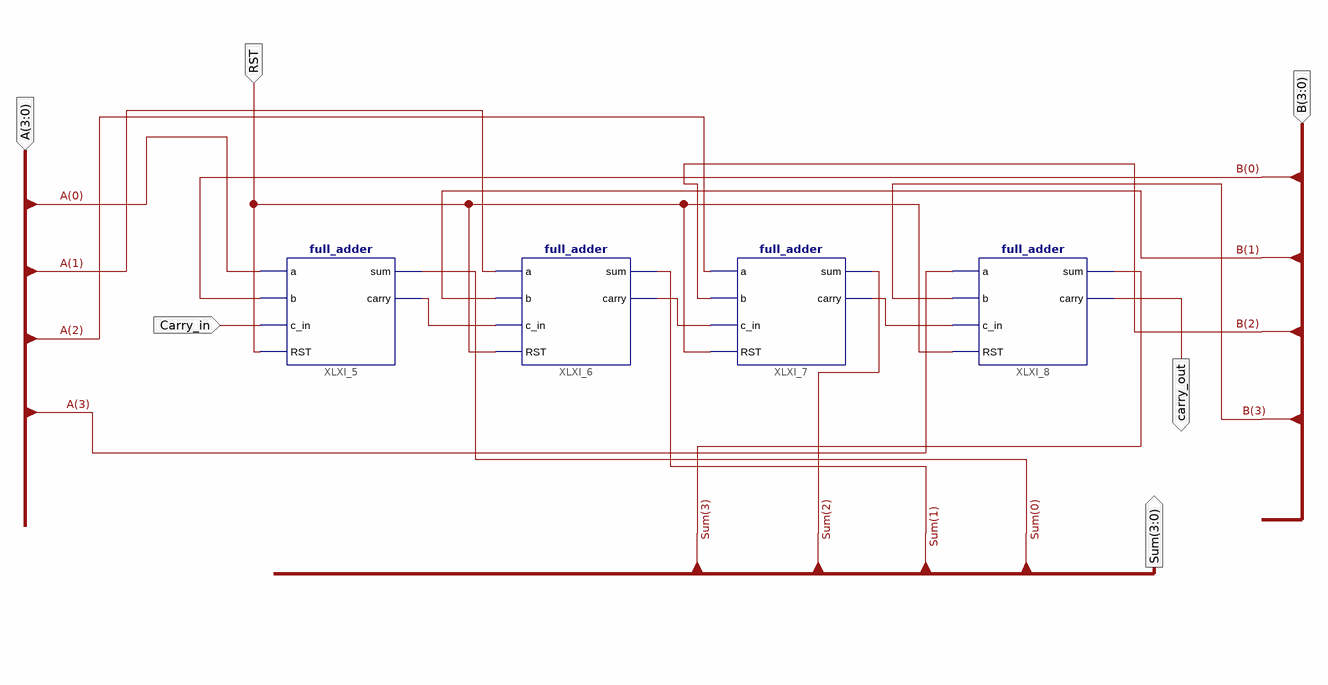
[diagram p0: schematic sheet 1]
// Xilinx ISE schematic full_adder4.sch (artix7) as structural Verilog: 4 symbols, 6 ports
module full_adder4 (
  input  RST,
  input  [3:0] A,
  input  [3:0] B,
  input  Carry_in,
  output carry_out,
  output [3:0] Sum
);

  wire XLXN_1, XLXN_2, XLXN_3;

  full_adder XLXI_5 (.a(A[0]), .b(B[0]), .carry(XLXN_1), .c_in(Carry_in), .RST(RST), .sum(Sum[0]));
  full_adder XLXI_6 (.a(A[1]), .b(B[1]), .carry(XLXN_2), .c_in(XLXN_1), .RST(RST), .sum(Sum[1]));
  full_adder XLXI_7 (.a(A[2]), .b(B[2]), .carry(XLXN_3), .c_in(XLXN_2), .RST(RST), .sum(Sum[2]));
  full_adder XLXI_8 (.a(A[3]), .b(B[3]), .carry(carry_out), .c_in(XLXN_3), .RST(RST), .sum(Sum[3]));
endmodule
